# Altium schematic sheet MC50_CPU.SchDoc
size A3
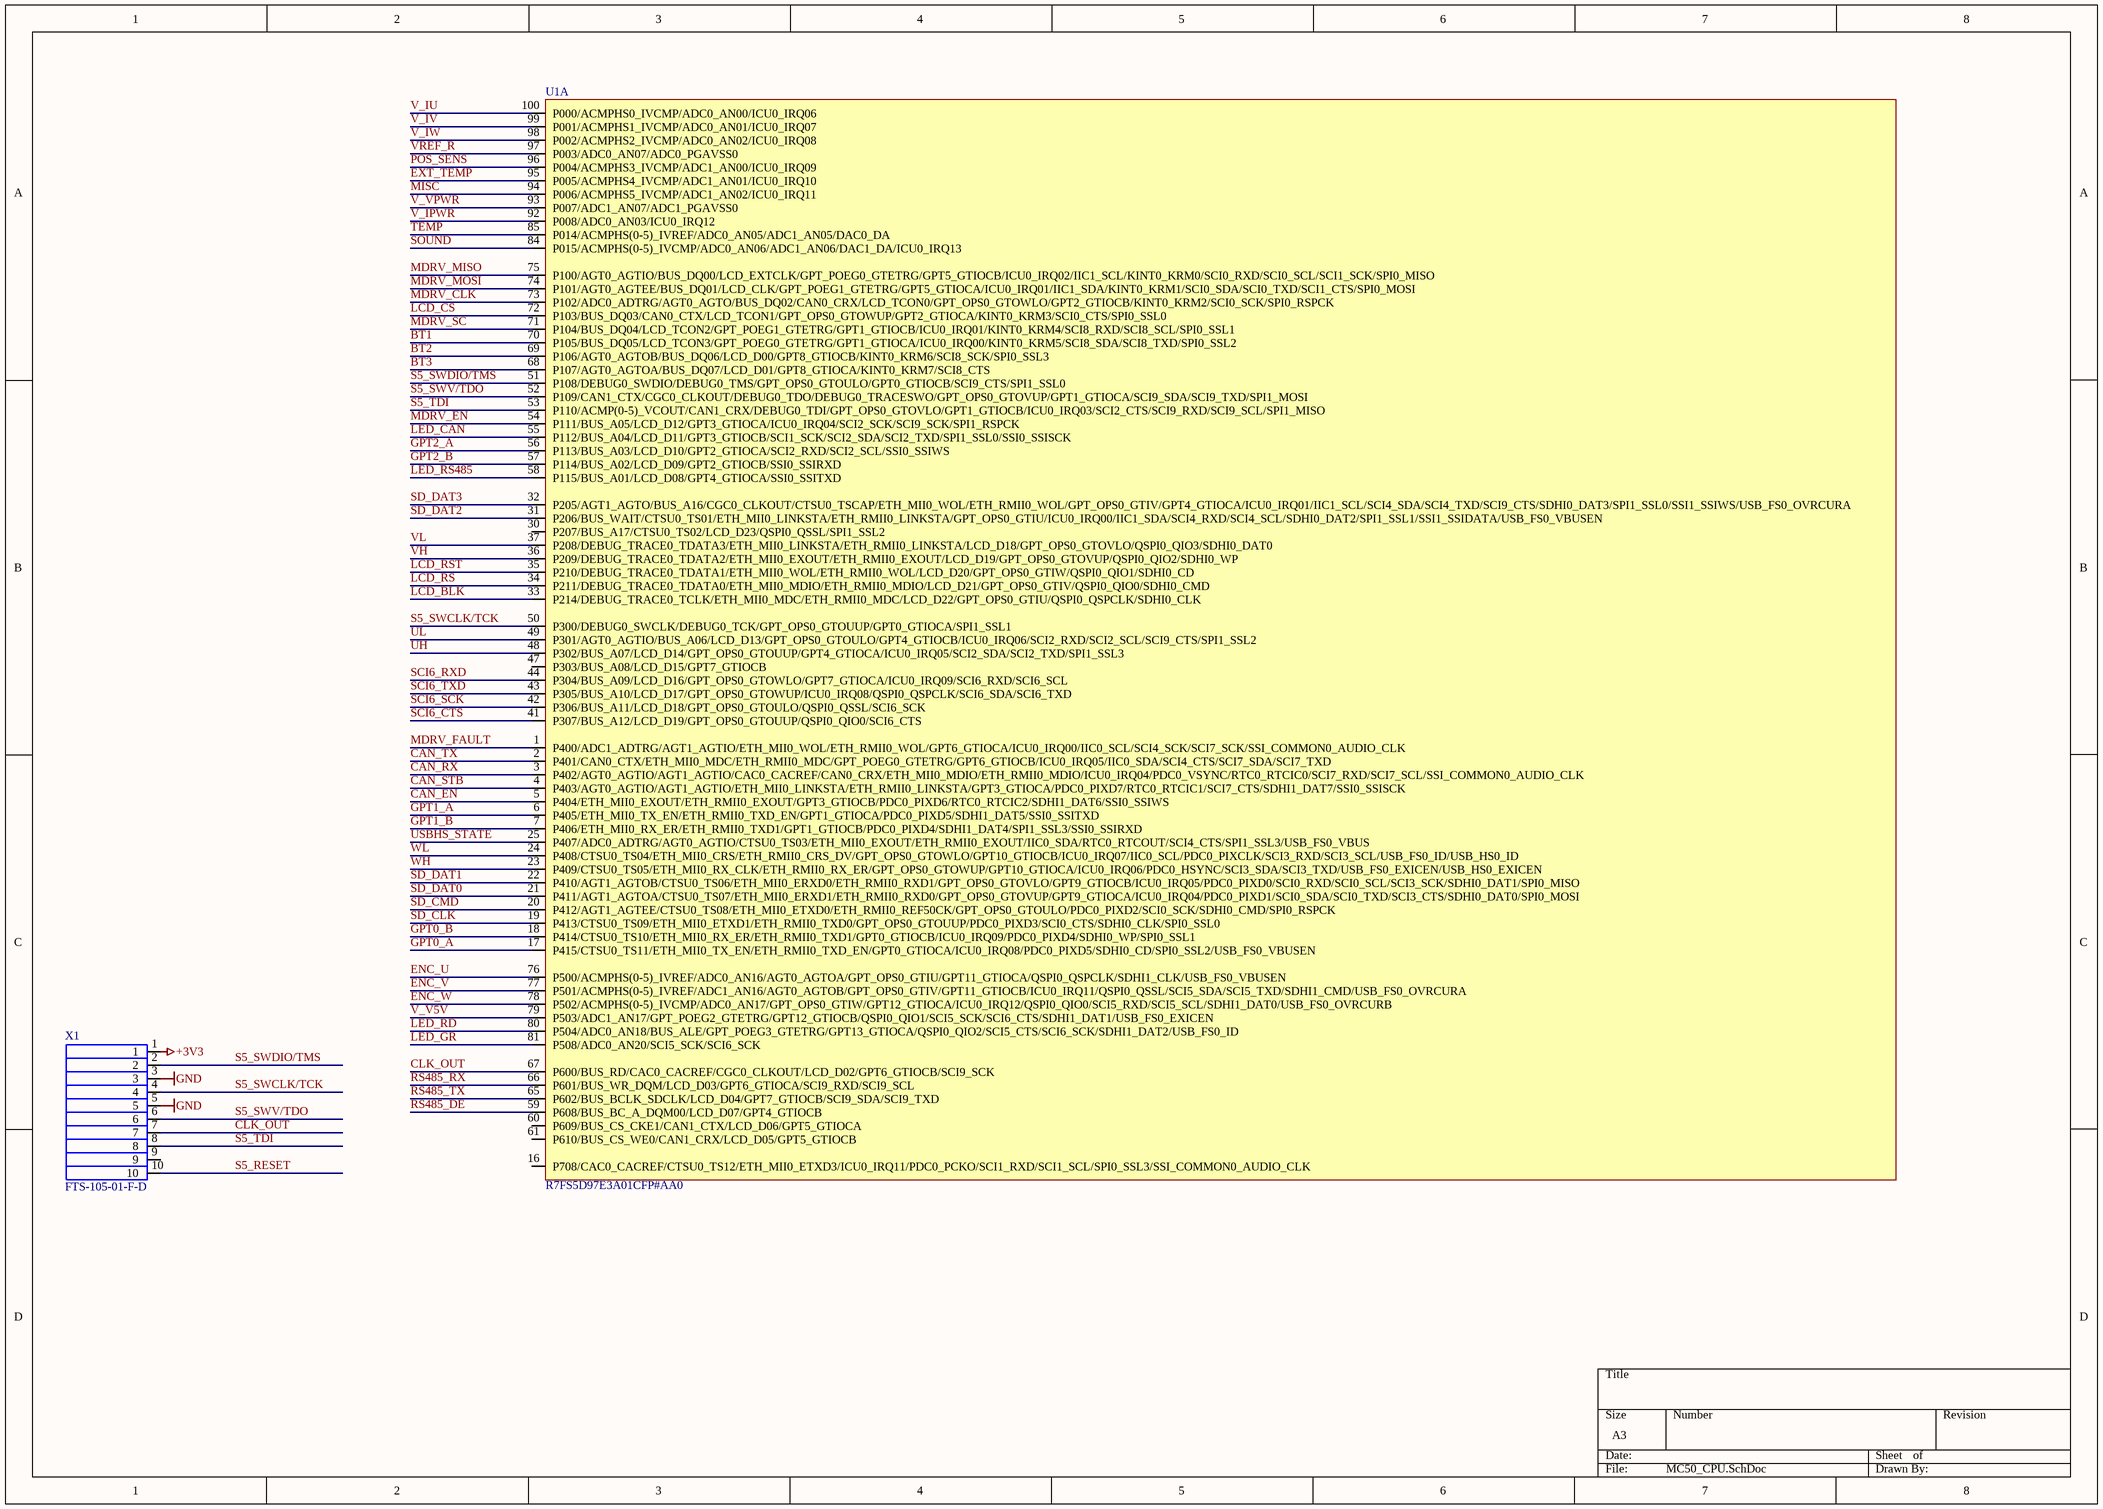
[diagram p0: MC50_CPU.SchDoc]

## Parts
U1  R7FS5D97E3A01CFP#AA0  [P-LFQFP100-14x14-0.50]  (part A of 2)
X1  FTS-105-01-F-D  [FTS-105-01-F-D]

## Nets
+3V3: X1.1
GND: X1.3 X1.5
BT1: U1.70(P105/BUS_DQ05/LCD_TCON3/GPT_POEG0_GTETRG/GPT1_GTIOCA/ICU0_IRQ00/KINT0_KRM5/SCI8_SDA/SCI8_TXD/SPI0_SSL2)
BT2: U1.69(P106/AGT0_AGTOB/BUS_DQ06/LCD_D00/GPT8_GTIOCB/KINT0_KRM6/SCI8_SCK/SPI0_SSL3)
BT3: U1.68(P107/AGT0_AGTOA/BUS_DQ07/LCD_D01/GPT8_GTIOCA/KINT0_KRM7/SCI8_CTS)
CAN_EN: U1.5(P404/ETH_MII0_EXOUT/ETH_RMII0_EXOUT/GPT3_GTIOCB/PDC0_PIXD6/RTC0_RTCIC2/SDHI1_DAT6/SSI0_SSIWS)
CAN_RX: U1.3(P402/AGT0_AGTIO/AGT1_AGTIO/CAC0_CACREF/CAN0_CRX/ETH_MII0_MDIO/ETH_RMII0_MDIO/ICU0_IRQ04/PDC0_VSYNC/RTC0_RTCIC0/SCI7_RXD/SCI7_SCL/SSI_COMMON0_AUDIO_CLK)
CAN_STB: U1.4(P403/AGT0_AGTIO/AGT1_AGTIO/ETH_MII0_LINKSTA/ETH_RMII0_LINKSTA/GPT3_GTIOCA/PDC0_PIXD7/RTC0_RTCIC1/SCI7_CTS/SDHI1_DAT7/SSI0_SSISCK)
CAN_TX: U1.2(P401/CAN0_CTX/ETH_MII0_MDC/ETH_RMII0_MDC/GPT_POEG0_GTETRG/GPT6_GTIOCB/ICU0_IRQ05/IIC0_SDA/SCI4_CTS/SCI7_SDA/SCI7_TXD)
CLK_OUT: U1.67(P600/BUS_RD/CAC0_CACREF/CGC0_CLKOUT/LCD_D02/GPT6_GTIOCB/SCI9_SCK) X1.7
ENC_U: U1.76(P500/ACMPHS(0-5)_IVREF/ADC0_AN16/AGT0_AGTOA/GPT_OPS0_GTIU/GPT11_GTIOCA/QSPI0_QSPCLK/SDHI1_CLK/USB_FS0_VBUSEN)
ENC_V: U1.77(P501/ACMPHS(0-5)_IVREF/ADC1_AN16/AGT0_AGTOB/GPT_OPS0_GTIV/GPT11_GTIOCB/ICU0_IRQ11/QSPI0_QSSL/SCI5_SDA/SCI5_TXD/SDHI1_CMD/USB_FS0_OVRCURA)
ENC_W: U1.78(P502/ACMPHS(0-5)_IVCMP/ADC0_AN17/GPT_OPS0_GTIW/GPT12_GTIOCA/ICU0_IRQ12/QSPI0_QIO0/SCI5_RXD/SCI5_SCL/SDHI1_DAT0/USB_FS0_OVRCURB)
EXT_TEMP: U1.95(P005/ACMPHS4_IVCMP/ADC1_AN01/ICU0_IRQ10)
GPT0_A: U1.17(P415/CTSU0_TS11/ETH_MII0_TX_EN/ETH_RMII0_TXD_EN/GPT0_GTIOCA/ICU0_IRQ08/PDC0_PIXD5/SDHI0_CD/SPI0_SSL2/USB_FS0_VBUSEN)
GPT0_B: U1.18(P414/CTSU0_TS10/ETH_MII0_RX_ER/ETH_RMII0_TXD1/GPT0_GTIOCB/ICU0_IRQ09/PDC0_PIXD4/SDHI0_WP/SPI0_SSL1)
GPT1_A: U1.6(P405/ETH_MII0_TX_EN/ETH_RMII0_TXD_EN/GPT1_GTIOCA/PDC0_PIXD5/SDHI1_DAT5/SSI0_SSITXD)
GPT1_B: U1.7(P406/ETH_MII0_RX_ER/ETH_RMII0_TXD1/GPT1_GTIOCB/PDC0_PIXD4/SDHI1_DAT4/SPI1_SSL3/SSI0_SSIRXD)
GPT2_A: U1.56(P113/BUS_A03/LCD_D10/GPT2_GTIOCA/SCI2_RXD/SCI2_SCL/SSI0_SSIWS)
GPT2_B: U1.57(P114/BUS_A02/LCD_D09/GPT2_GTIOCB/SSI0_SSIRXD)
LCD_BLK: U1.33(P214/DEBUG_TRACE0_TCLK/ETH_MII0_MDC/ETH_RMII0_MDC/LCD_D22/GPT_OPS0_GTIU/QSPI0_QSPCLK/SDHI0_CLK)
LCD_CS: U1.72(P103/BUS_DQ03/CAN0_CTX/LCD_TCON1/GPT_OPS0_GTOWUP/GPT2_GTIOCA/KINT0_KRM3/SCI0_CTS/SPI0_SSL0)
LCD_RS: U1.34(P211/DEBUG_TRACE0_TDATA0/ETH_MII0_MDIO/ETH_RMII0_MDIO/LCD_D21/GPT_OPS0_GTIV/QSPI0_QIO0/SDHI0_CMD)
LCD_RST: U1.35(P210/DEBUG_TRACE0_TDATA1/ETH_MII0_WOL/ETH_RMII0_WOL/LCD_D20/GPT_OPS0_GTIW/QSPI0_QIO1/SDHI0_CD)
LED_CAN: U1.55(P112/BUS_A04/LCD_D11/GPT3_GTIOCB/SCI1_SCK/SCI2_SDA/SCI2_TXD/SPI1_SSL0/SSI0_SSISCK)
LED_GR: U1.81(P508/ADC0_AN20/SCI5_SCK/SCI6_SCK)
LED_RD: U1.80(P504/ADC0_AN18/BUS_ALE/GPT_POEG3_GTETRG/GPT13_GTIOCA/QSPI0_QIO2/SCI5_CTS/SCI6_SCK/SDHI1_DAT2/USB_FS0_ID)
LED_RS485: U1.58(P115/BUS_A01/LCD_D08/GPT4_GTIOCA/SSI0_SSITXD)
MDRV_CLK: U1.73(P102/ADC0_ADTRG/AGT0_AGTO/BUS_DQ02/CAN0_CRX/LCD_TCON0/GPT_OPS0_GTOWLO/GPT2_GTIOCB/KINT0_KRM2/SCI0_SCK/SPI0_RSPCK)
MDRV_EN: U1.54(P111/BUS_A05/LCD_D12/GPT3_GTIOCA/ICU0_IRQ04/SCI2_SCK/SCI9_SCK/SPI1_RSPCK)
MDRV_FAULT: U1.1(P400/ADC1_ADTRG/AGT1_AGTIO/ETH_MII0_WOL/ETH_RMII0_WOL/GPT6_GTIOCA/ICU0_IRQ00/IIC0_SCL/SCI4_SCK/SCI7_SCK/SSI_COMMON0_AUDIO_CLK)
MDRV_MISO: U1.75(P100/AGT0_AGTIO/BUS_DQ00/LCD_EXTCLK/GPT_POEG0_GTETRG/GPT5_GTIOCB/ICU0_IRQ02/IIC1_SCL/KINT0_KRM0/SCI0_RXD/SCI0_SCL/SCI1_SCK/SPI0_MISO)
MDRV_MOSI: U1.74(P101/AGT0_AGTEE/BUS_DQ01/LCD_CLK/GPT_POEG1_GTETRG/GPT5_GTIOCA/ICU0_IRQ01/IIC1_SDA/KINT0_KRM1/SCI0_SDA/SCI0_TXD/SCI1_CTS/SPI0_MOSI)
MDRV_SC: U1.71(P104/BUS_DQ04/LCD_TCON2/GPT_POEG1_GTETRG/GPT1_GTIOCB/ICU0_IRQ01/KINT0_KRM4/SCI8_RXD/SCI8_SCL/SPI0_SSL1)
MISC: U1.94(P006/ACMPHS5_IVCMP/ADC1_AN02/ICU0_IRQ11)
POS_SENS: U1.96(P004/ACMPHS3_IVCMP/ADC1_AN00/ICU0_IRQ09)
RS485_DE: U1.59(P608/BUS_BC_A_DQM00/LCD_D07/GPT4_GTIOCB)
RS485_RX: U1.66(P601/BUS_WR_DQM/LCD_D03/GPT6_GTIOCA/SCI9_RXD/SCI9_SCL)
RS485_TX: U1.65(P602/BUS_BCLK_SDCLK/LCD_D04/GPT7_GTIOCB/SCI9_SDA/SCI9_TXD)
S5_RESET: X1.10
S5_SWCLK/TCK: U1.50(P300/DEBUG0_SWCLK/DEBUG0_TCK/GPT_OPS0_GTOUUP/GPT0_GTIOCA/SPI1_SSL1) X1.4
S5_SWDIO/TMS: U1.51(P108/DEBUG0_SWDIO/DEBUG0_TMS/GPT_OPS0_GTOULO/GPT0_GTIOCB/SCI9_CTS/SPI1_SSL0) X1.2
S5_SWV/TDO: U1.52(P109/CAN1_CTX/CGC0_CLKOUT/DEBUG0_TDO/DEBUG0_TRACESWO/GPT_OPS0_GTOVUP/GPT1_GTIOCA/SCI9_SDA/SCI9_TXD/SPI1_MOSI) X1.6
S5_TDI: U1.53(P110/ACMP(0-5)_VCOUT/CAN1_CRX/DEBUG0_TDI/GPT_OPS0_GTOVLO/GPT1_GTIOCB/ICU0_IRQ03/SCI2_CTS/SCI9_RXD/SCI9_SCL/SPI1_MISO) X1.8
SCI6_CTS: U1.41(P307/BUS_A12/LCD_D19/GPT_OPS0_GTOUUP/QSPI0_QIO0/SCI6_CTS)
SCI6_RXD: U1.44(P304/BUS_A09/LCD_D16/GPT_OPS0_GTOWLO/GPT7_GTIOCA/ICU0_IRQ09/SCI6_RXD/SCI6_SCL)
SCI6_SCK: U1.42(P306/BUS_A11/LCD_D18/GPT_OPS0_GTOULO/QSPI0_QSSL/SCI6_SCK)
SCI6_TXD: U1.43(P305/BUS_A10/LCD_D17/GPT_OPS0_GTOWUP/ICU0_IRQ08/QSPI0_QSPCLK/SCI6_SDA/SCI6_TXD)
SD_CLK: U1.19(P413/CTSU0_TS09/ETH_MII0_ETXD1/ETH_RMII0_TXD0/GPT_OPS0_GTOUUP/PDC0_PIXD3/SCI0_CTS/SDHI0_CLK/SPI0_SSL0)
SD_CMD: U1.20(P412/AGT1_AGTEE/CTSU0_TS08/ETH_MII0_ETXD0/ETH_RMII0_REF50CK/GPT_OPS0_GTOULO/PDC0_PIXD2/SCI0_SCK/SDHI0_CMD/SPI0_RSPCK)
SD_DAT0: U1.21(P411/AGT1_AGTOA/CTSU0_TS07/ETH_MII0_ERXD1/ETH_RMII0_RXD0/GPT_OPS0_GTOVUP/GPT9_GTIOCA/ICU0_IRQ04/PDC0_PIXD1/SCI0_SDA/SCI0_TXD/SCI3_CTS/SDHI0_DAT0/SPI0_MOSI)
SD_DAT1: U1.22(P410/AGT1_AGTOB/CTSU0_TS06/ETH_MII0_ERXD0/ETH_RMII0_RXD1/GPT_OPS0_GTOVLO/GPT9_GTIOCB/ICU0_IRQ05/PDC0_PIXD0/SCI0_RXD/SCI0_SCL/SCI3_SCK/SDHI0_DAT1/SPI0_MISO)
SD_DAT2: U1.31(P206/BUS_WAIT/CTSU0_TS01/ETH_MII0_LINKSTA/ETH_RMII0_LINKSTA/GPT_OPS0_GTIU/ICU0_IRQ00/IIC1_SDA/SCI4_RXD/SCI4_SCL/SDHI0_DAT2/SPI1_SSL1/SSI1_SSIDATA/USB_FS0_VBUSEN)
SD_DAT3: U1.32(P205/AGT1_AGTO/BUS_A16/CGC0_CLKOUT/CTSU0_TSCAP/ETH_MII0_WOL/ETH_RMII0_WOL/GPT_OPS0_GTIV/GPT4_GTIOCA/ICU0_IRQ01/IIC1_SCL/SCI4_SDA/SCI4_TXD/SCI9_CTS/SDHI0_DAT3/SPI1_SSL0/SSI1_SSIWS/USB_FS0_OVRCURA)
SOUND: U1.84(P015/ACMPHS(0-5)_IVCMP/ADC0_AN06/ADC1_AN06/DAC1_DA/ICU0_IRQ13)
TEMP: U1.85(P014/ACMPHS(0-5)_IVREF/ADC0_AN05/ADC1_AN05/DAC0_DA)
UH: U1.48(P302/BUS_A07/LCD_D14/GPT_OPS0_GTOUUP/GPT4_GTIOCA/ICU0_IRQ05/SCI2_SDA/SCI2_TXD/SPI1_SSL3)
UL: U1.49(P301/AGT0_AGTIO/BUS_A06/LCD_D13/GPT_OPS0_GTOULO/GPT4_GTIOCB/ICU0_IRQ06/SCI2_RXD/SCI2_SCL/SCI9_CTS/SPI1_SSL2)
USBHS_STATE: U1.25(P407/ADC0_ADTRG/AGT0_AGTIO/CTSU0_TS03/ETH_MII0_EXOUT/ETH_RMII0_EXOUT/IIC0_SDA/RTC0_RTCOUT/SCI4_CTS/SPI1_SSL3/USB_FS0_VBUS)
V_IPWR: U1.92(P008/ADC0_AN03/ICU0_IRQ12)
V_IU: U1.100(P000/ACMPHS0_IVCMP/ADC0_AN00/ICU0_IRQ06)
V_IV: U1.99(P001/ACMPHS1_IVCMP/ADC0_AN01/ICU0_IRQ07)
V_IW: U1.98(P002/ACMPHS2_IVCMP/ADC0_AN02/ICU0_IRQ08)
V_V5V: U1.79(P503/ADC1_AN17/GPT_POEG2_GTETRG/GPT12_GTIOCB/QSPI0_QIO1/SCI5_SCK/SCI6_CTS/SDHI1_DAT1/USB_FS0_EXICEN)
V_VPWR: U1.93(P007/ADC1_AN07/ADC1_PGAVSS0)
VH: U1.36(P209/DEBUG_TRACE0_TDATA2/ETH_MII0_EXOUT/ETH_RMII0_EXOUT/LCD_D19/GPT_OPS0_GTOVUP/QSPI0_QIO2/SDHI0_WP)
VL: U1.37(P208/DEBUG_TRACE0_TDATA3/ETH_MII0_LINKSTA/ETH_RMII0_LINKSTA/LCD_D18/GPT_OPS0_GTOVLO/QSPI0_QIO3/SDHI0_DAT0)
VREF_R: U1.97(P003/ADC0_AN07/ADC0_PGAVSS0)
WH: U1.23(P409/CTSU0_TS05/ETH_MII0_RX_CLK/ETH_RMII0_RX_ER/GPT_OPS0_GTOWUP/GPT10_GTIOCA/ICU0_IRQ06/PDC0_HSYNC/SCI3_SDA/SCI3_TXD/USB_FS0_EXICEN/USB_HS0_EXICEN)
WL: U1.24(P408/CTSU0_TS04/ETH_MII0_CRS/ETH_RMII0_CRS_DV/GPT_OPS0_GTOWLO/GPT10_GTIOCB/ICU0_IRQ07/IIC0_SCL/PDC0_PIXCLK/SCI3_RXD/SCI3_SCL/USB_FS0_ID/USB_HS0_ID)

Not connected (* = marked no-connect by the designer): U1 16(P708/CAC0_CACREF/CTSU0_TS12/ETH_MII0_ETXD3/ICU0_IRQ11/PDC0_PCKO/SCI1_RXD/SCI1_SCL/SPI0_SSL3/SSI_COMMON0_AUDIO_CLK) 30(P207/BUS_A17/CTSU0_TS02/LCD_D23/QSPI0_QSSL/SPI1_SSL2) 47(P303/BUS_A08/LCD_D15/GPT7_GTIOCB) 60(P609/BUS_CS_CKE1/CAN1_CTX/LCD_D06/GPT5_GTIOCA) 61(P610/BUS_CS_WE0/CAN1_CRX/LCD_D05/GPT5_GTIOCB); X1 9

## Library data of the parts
U1 = R7FS5D97E3A01CFP#AA0: Manufacturer: Renesas; PartNum: 968-S5D97E3A01CFPAA0; Distributor: Mouser; PartName: R7FS5D97E3A01CFP#AA0; Price: 18.78$
X1 = FTS-105-01-F-D: Board-To-Board Connector, Vertical, FTS Series, Through Hole, Header, 10, 1.27 mm; Manufacturer: SAMTEC; PartNum: 1928242; Distributor: Farnell; PartName: FTS-105-01-F-D